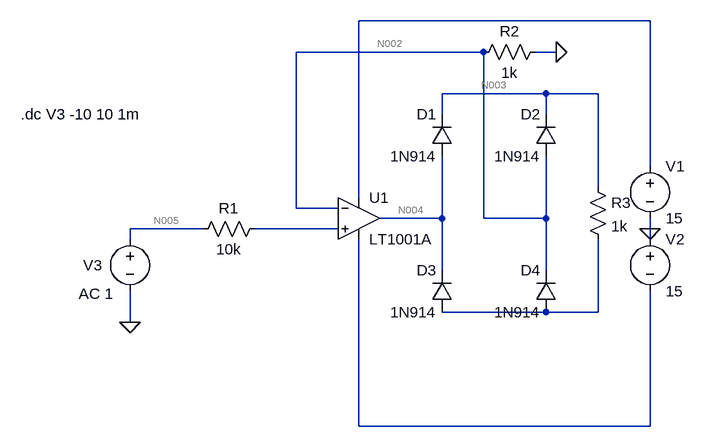
[diagram p0: schematic ExpAmp.asc]
ExpAmp.asc, the LTspice schematic file:
Version 4
SHEET 1 880 680
WIRE 768 -192 320 -192
WIRE 512 -144 224 -144
WIRE 624 -144 592 -144
WIRE 608 -80 448 -80
WIRE 688 -80 608 -80
WIRE 448 -48 448 -80
WIRE 608 -48 608 -80
WIRE 768 32 768 -192
WIRE 688 64 688 -80
WIRE 320 80 320 -192
WIRE 224 96 224 -144
WIRE 288 96 224 96
WIRE 448 112 448 16
WIRE 448 112 352 112
WIRE 512 112 512 -144
WIRE 608 112 608 16
WIRE 608 112 512 112
WIRE 80 128 -32 128
WIRE 288 128 160 128
WIRE 768 128 768 112
WIRE -32 144 -32 128
WIRE 768 144 768 128
WIRE 448 192 448 112
WIRE 608 192 608 112
WIRE 608 256 448 256
WIRE 688 256 688 144
WIRE 688 256 608 256
WIRE -32 272 -32 224
WIRE 320 432 320 144
WIRE 768 432 768 224
WIRE 768 432 320 432
FLAG -32 272 0
FLAG 768 128 0
FLAG 624 -144 0
SYMBOL voltage 768 16 R0
WINDOW 123 0 0 Left 2
WINDOW 39 0 0 Left 2
SYMATTR InstName V1
SYMATTR Value 15
SYMBOL voltage 768 128 R0
WINDOW 123 0 0 Left 2
WINDOW 39 0 0 Left 2
SYMATTR InstName V2
SYMATTR Value 15
SYMBOL Opamps\\LT1001A 320 48 R0
SYMATTR InstName U1
SYMBOL voltage -32 128 R0
WINDOW 0 -72 56 Left 2
WINDOW 3 -301 -26 Invisible 2
WINDOW 123 -79 100 Left 2
WINDOW 39 0 0 Left 2
SYMATTR InstName V3
SYMATTR Value 1
SYMATTR Value2 AC 1
SYMBOL diode 464 16 R180
WINDOW 0 24 64 Left 2
WINDOW 3 24 0 Left 2
SYMATTR InstName D1
SYMATTR Value 1N914
SYMBOL res 176 112 R90
WINDOW 0 0 56 VBottom 2
WINDOW 3 32 56 VTop 2
SYMATTR InstName R1
SYMATTR Value 10k
SYMBOL diode 624 16 R180
WINDOW 0 24 64 Left 2
WINDOW 3 24 0 Left 2
SYMATTR InstName D2
SYMATTR Value 1N914
SYMBOL diode 464 256 R180
WINDOW 0 24 64 Left 2
WINDOW 3 24 0 Left 2
SYMATTR InstName D3
SYMATTR Value 1N914
SYMBOL diode 624 256 R180
WINDOW 0 24 64 Left 2
WINDOW 3 24 0 Left 2
SYMATTR InstName D4
SYMATTR Value 1N914
SYMBOL res 496 -128 R270
WINDOW 0 32 56 VTop 2
WINDOW 3 0 56 VBottom 2
SYMATTR InstName R2
SYMATTR Value 1k
SYMBOL res 672 48 R0
SYMATTR InstName R3
SYMATTR Value 1k
TEXT -200 -48 Left 2 !.dc V3 -10 10 1m

The netlist it stands for:
* ExpAmp.asc
V1 N001 0 15
V2 0 N008 15
XU1 N006 N002 N001 N008 N004 LT1001  ; LT1001A, pins In+ In- V+ V- OUT
V3 N005 0 1 AC 1
D1 N004 N003 1N914
R1 N006 N005 10k
D2 N002 N003 1N914
D3 N007 N004 1N914
D4 N007 N002 1N914
R2 N002 0 1k
R3 N003 N007 1k
.model D D
.lib standard.dio
.dc V3 -10 10 1m
.lib LTC.lib
.backanno
.end

* Results of the author's LTspice run, read from the files saved beside the schematic
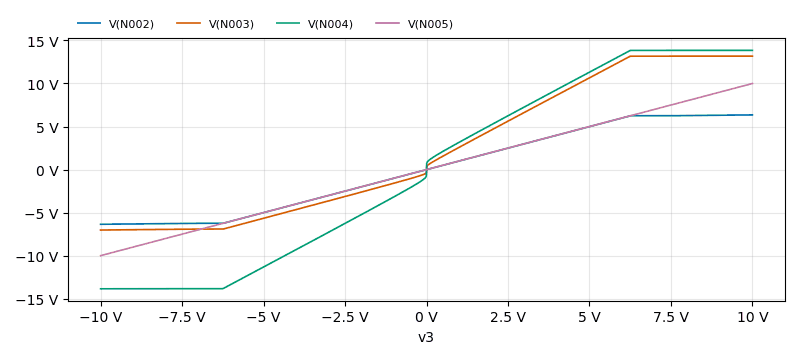
[diagram p1: DC transfer characteristic of ExpAmp.asc, plotted from the saved traces]
* DC transfer characteristic, 1 run:
*   V(N002): -6.353 V at v3=-10 V, 6.353 V at v3=10 V, min -6.353 V, max 6.353 V
*   V(N003): -7.023 V at v3=-10 V, 13.18 V at v3=10 V, min -7.023 V, max 13.18 V
*   V(N004): -13.85 V at v3=-10 V, 13.85 V at v3=10 V, min -13.85 V, max 13.85 V
*   V(N005): -10 V at v3=-10 V, 10 V at v3=10 V, min -10 V, max 10 V